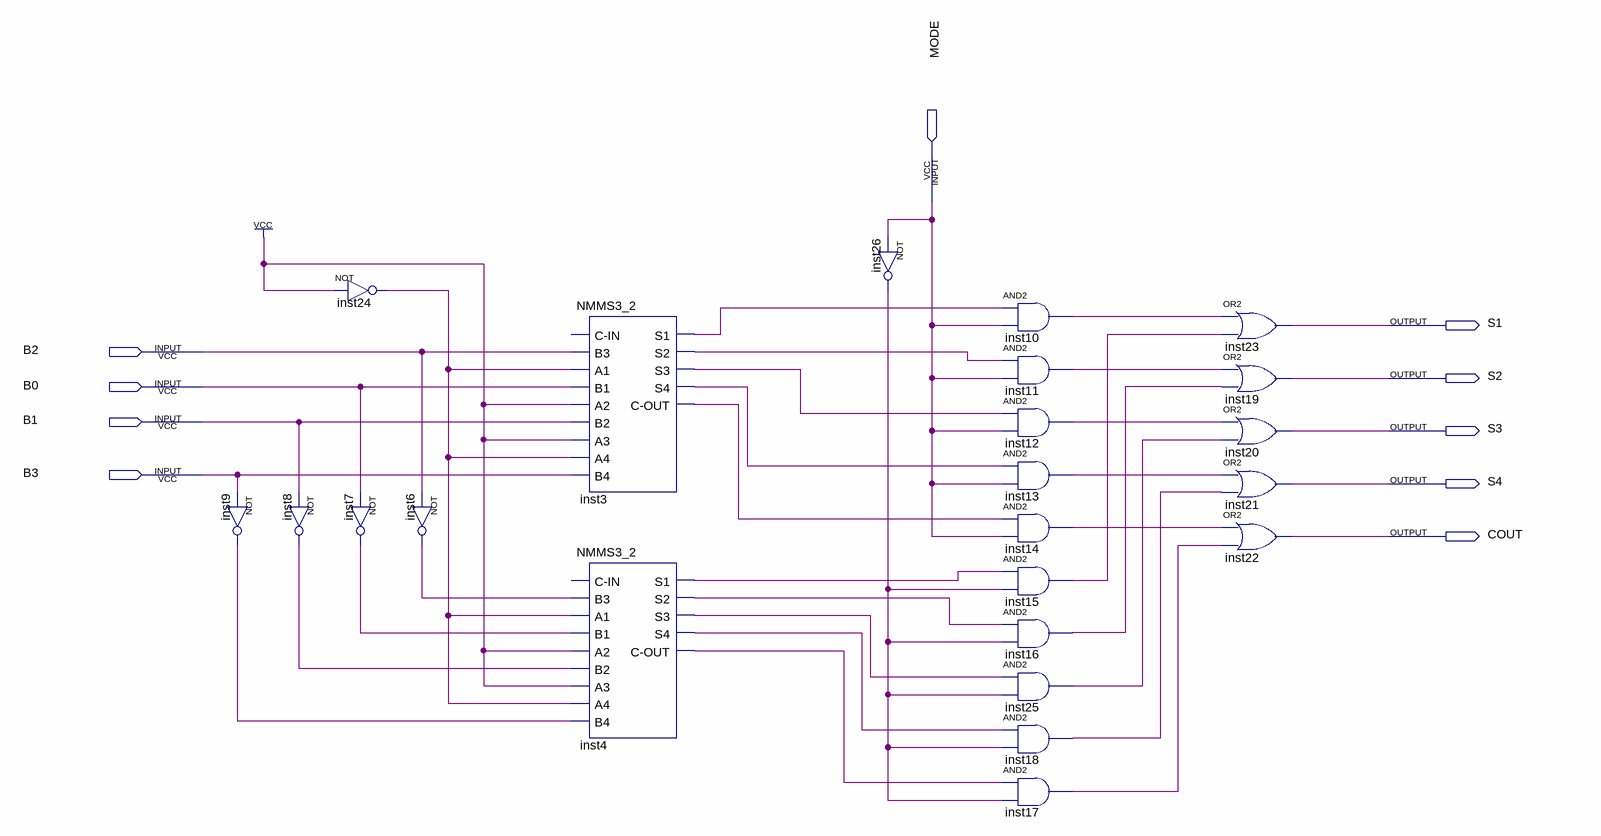
[diagram p0: schematic sheet]
// Quartus schematic ALU.bdf as structural Verilog: 23 symbols, 10 pins
module ALU (
  input  MODE,
  input  B2,
  input  B0,
  input  B1,
  input  B3,
  output S1,
  output S2,
  output S3,
  output S4,
  output COUT
);

  wire inst3_c_out, inst3_s1, inst3_s2, inst3_s3, inst3_s4, inst4_c_out, inst4_s1, inst4_s2, inst4_s3,
       inst4_s4, inst6_out, inst7_out, inst8_out, inst9_out, inst10_out, inst11_out, inst12_out, inst13_out,
       inst14_out, inst15_out, inst16_out, inst17_out, inst18_out, inst24_out, inst25_out, inst26_out;

  not inst9 (inst9_out, B3);
  not inst8 (inst8_out, B1);
  not inst24 (inst24_out, 1'b1);
  not inst7 (inst7_out, B0);
  not inst6 (inst6_out, B2);
  NMMS3_2 inst3 (
    .B3(B2), .A1(inst24_out), .B1(B0), .A2(1'b1), .B2(B1), .A3(1'b1), .A4(inst24_out), .B4(B3),
    .S1(inst3_s1), .S2(inst3_s2), .S3(inst3_s3), .S4(inst3_s4), .\C-OUT (inst3_c_out));  // open: C-IN
  NMMS3_2 inst4 (
    .B3(inst6_out), .A1(inst24_out), .B1(inst7_out), .A2(1'b1), .B2(inst8_out), .A3(1'b1), .A4(inst24_out),
    .B4(inst9_out), .S1(inst4_s1), .S2(inst4_s2), .S3(inst4_s3), .S4(inst4_s4), .\C-OUT (inst4_c_out));  // open: C-IN
  not inst26 (inst26_out, MODE);
  and inst10 (inst10_out, inst3_s1, MODE);
  and inst11 (inst11_out, inst3_s2, MODE);
  and inst12 (inst12_out, inst3_s3, MODE);
  and inst13 (inst13_out, inst3_s4, MODE);
  and inst14 (inst14_out, inst3_c_out, MODE);
  and inst15 (inst15_out, inst4_s1, inst26_out);
  and inst16 (inst16_out, inst4_s2, inst26_out);
  and inst25 (inst25_out, inst4_s3, inst26_out);
  and inst18 (inst18_out, inst4_s4, inst26_out);
  and inst17 (inst17_out, inst4_c_out, inst26_out);
  or inst23 (S1, inst10_out, inst15_out);
  or inst19 (S2, inst11_out, inst16_out);
  or inst20 (S3, inst12_out, inst25_out);
  or inst21 (S4, inst13_out, inst18_out);
  or inst22 (COUT, inst14_out, inst17_out);
endmodule
